# EasyEDA Pro project ProProject_Standalone Non Auto Modules_2024-08-11.epro

# Schematic INA219 V1.0
Create Date: 2024-08-10; Page Name: INA219 V1.0; Project Name: Standalone Non Auto Modules; Schematic Name: INA219 V1.0; Update Date: 2024-08-11; Drawn: Arwid Vasilev; Page Size: A4; Part Number: ARS_V002; Version: V1.0
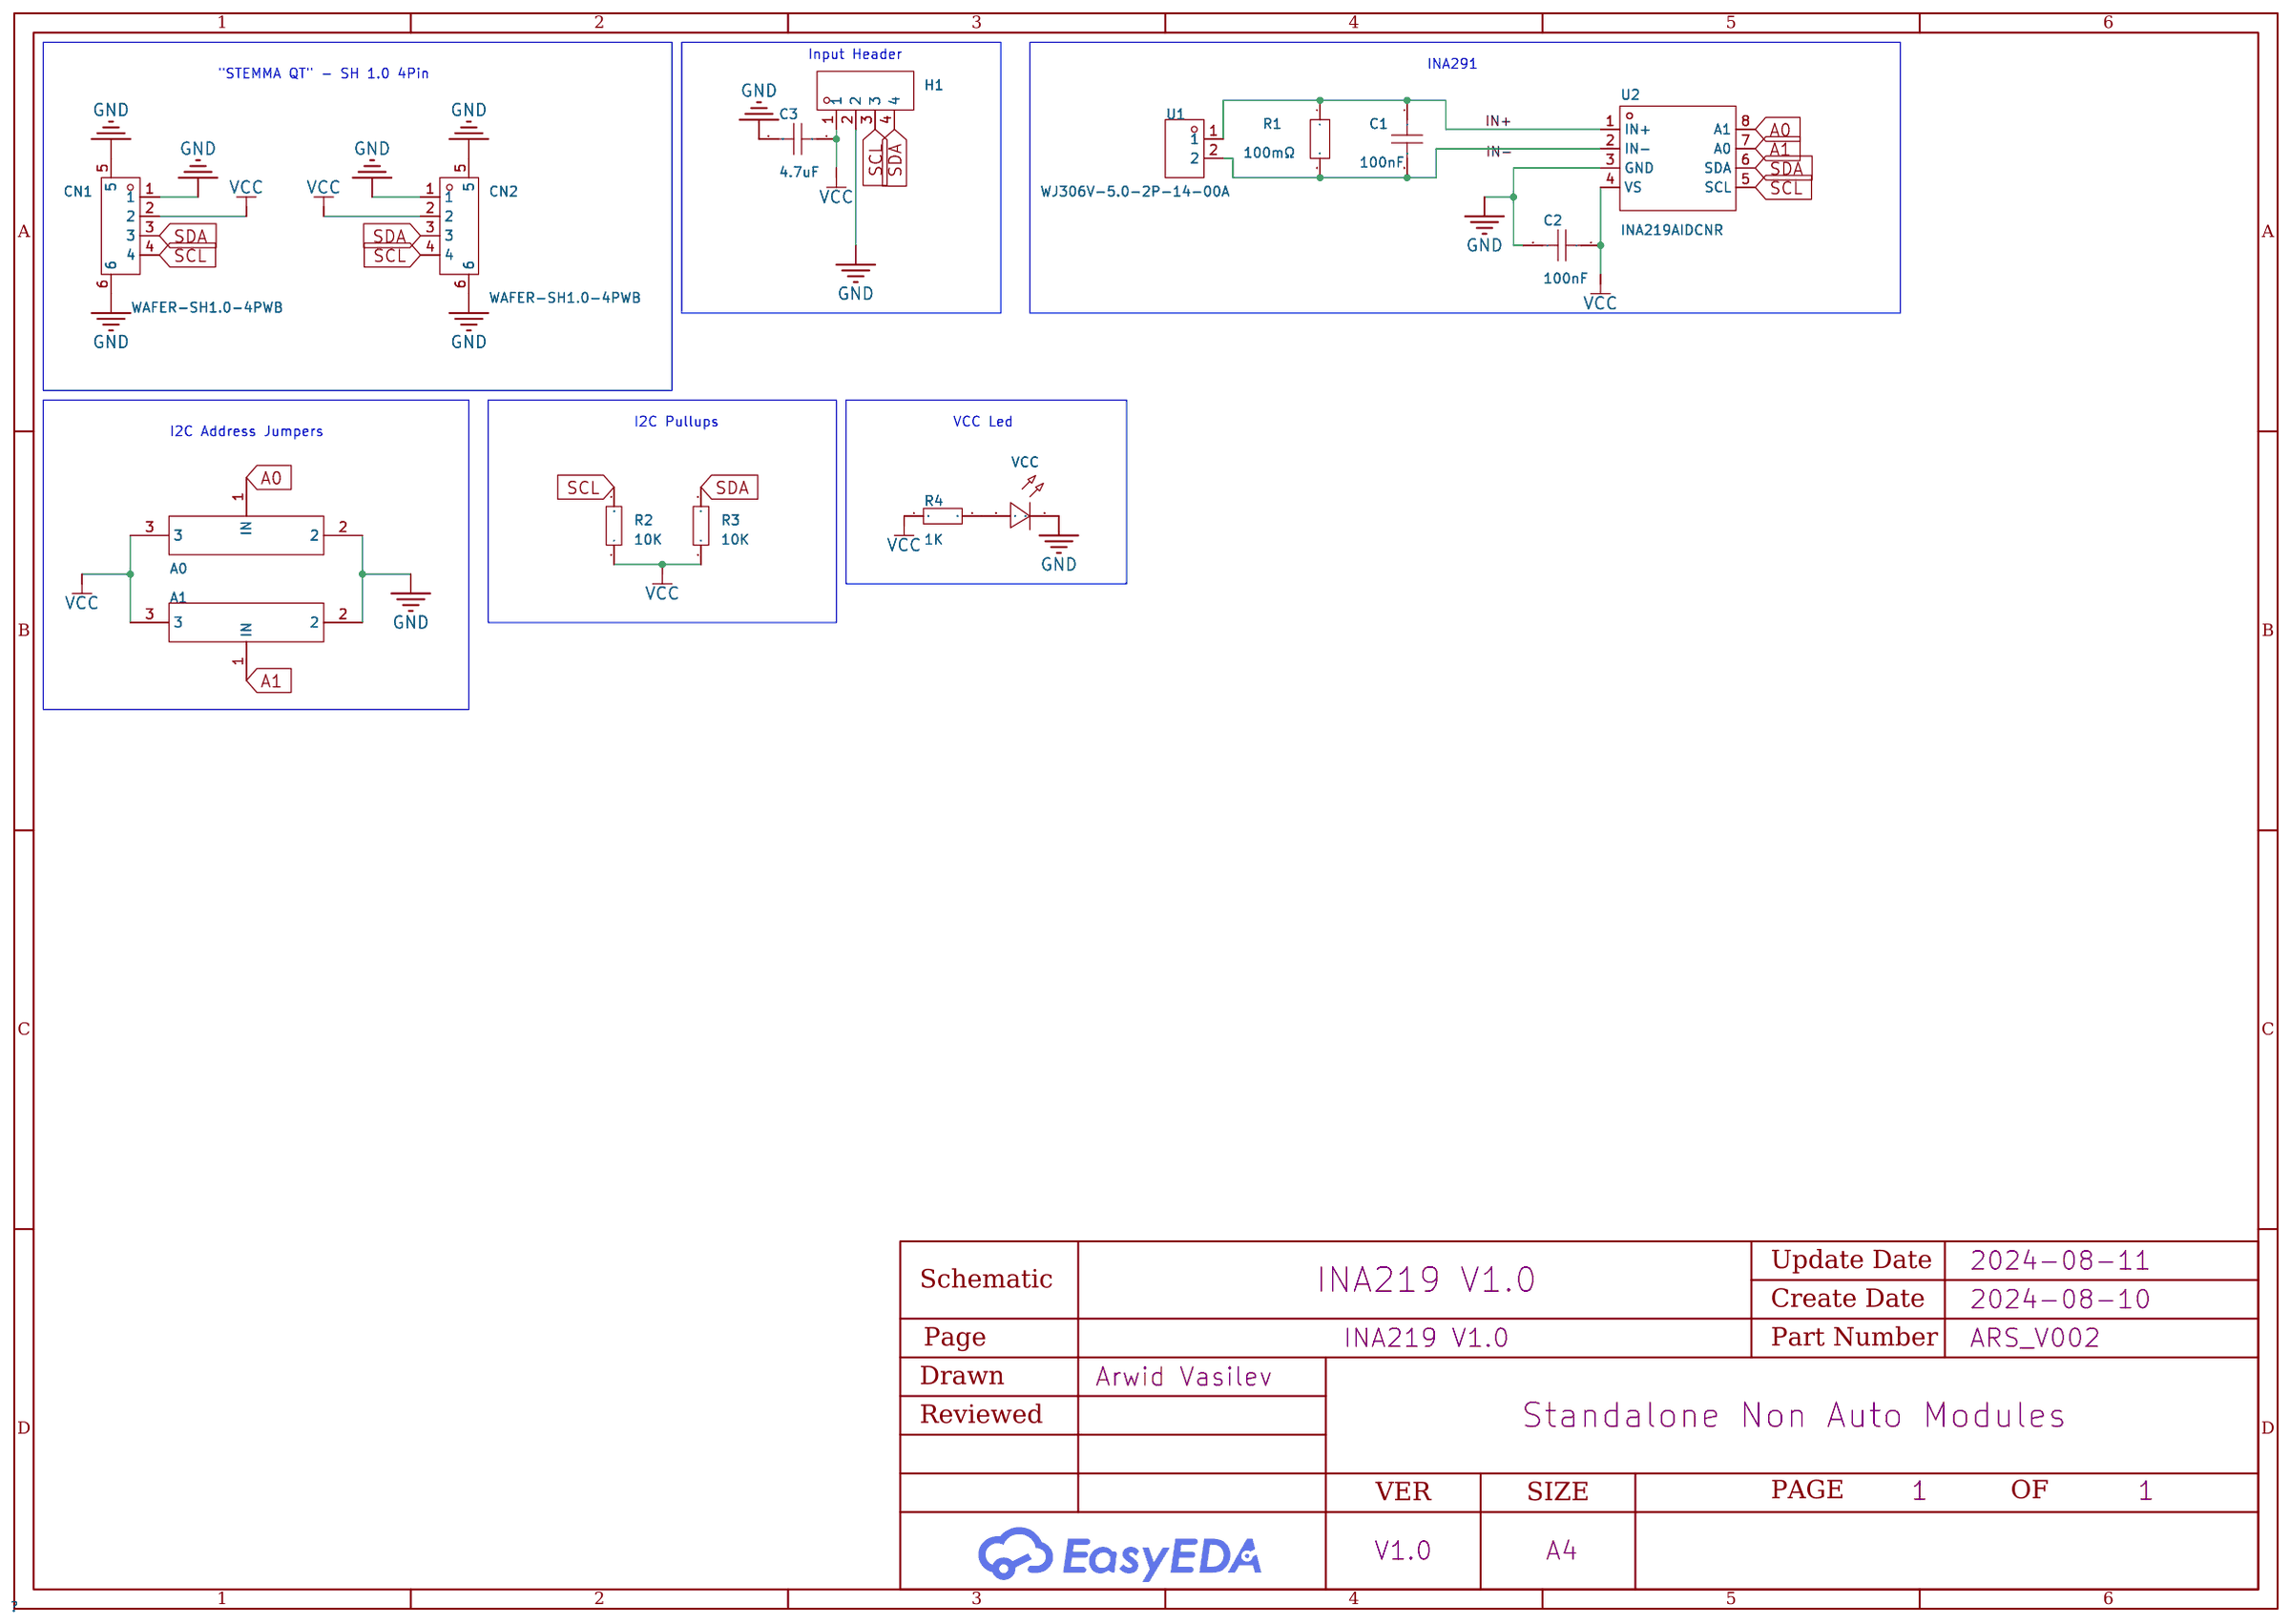
[diagram p0: schematic sheet]

## Parts
A0  -  [3 way solder Jumper]
A1  -  [3 way solder Jumper]
C1  100nF  [C0603]
C2  100nF  [C0603]
C3  4.7uF  [C0603]
CN1  WAFER-SH1.0-4PWB  [CONN-SMD_4P-P1.00_WAFER-SH1.0-4PWB]
CN2  WAFER-SH1.0-4PWB  [CONN-SMD_4P-P1.00_WAFER-SH1.0-4PWB]
H1  -  [HDR-TH_4P-P2.54-V-M]
R1  100mΩ  [RES-SMD_L6.4-W3.2-R2512]
R2  10K  [R0603]
R3  10K  [R0603]
R4  1K  [R0603]
U1  WJ306V-5.0-2P-14-00A  [CONN-TH_2P-P5.00_L7.6-W10.0]
U2  INA219AIDCNR  [SOT-23-8_L3.0-W1.7-P0.65-LS2.8-BR]
VCC  -  [LED0603-RD_GREEN]

## Library data of the parts
A0 A1 = 3 Way Solder Jumper
C1-C3 = CAP_0603: Supplier Footprint: 0603
CN1 CN2 = WAFER-SH1.0-4PWB: Pins Structure:1x4P Pitch:1mm Mounting Style:卧贴 Number of Pins:4P Number of Rows:1 Number of PINs Per Row:4 Current Rating (Max):1A Operating Temperature Range:-25℃~+85℃ Operating Temperature Range:-25℃~+85℃; LCSC Part Name: 1x4P 间距:1mm 卧贴; Supplier Part: C3029343; Manufacturer: XUNPU(讯普); Supplier Footprint: SMD,P=1mm,卧贴; JLCPCB Part Class: Extended Part; Datasheet: https://atta.szlcsc.com/upload/public/pdf/source/20220527/1879B8210BD3B2006BCEAC1A40D397B6.pdf; Supplier: LCSC; Pins Structure: 1x4P; Pitch: 1mm; Mounting Style: 卧贴; Number of Pins: 4P; Number of Rows: 1; Number of PINs Per Row: 4; Current Rating (Max): 1A; Operating Temperature Range: -25℃~+85℃
H1 = HDR-M_2.54_1x4P: Supplier Footprint: Through
R1 = HoJLR2512-3W-100mR-1%: Type:Current Sensing Resistors Resistance:100mΩ Tolerance:±1% Tolerance:±1% Power(Watts): Mounting Sytle:Surface Mount; LCSC Part Name: 100mΩ ±1% 3W; Supplier Part: C2903476; Manufacturer: Milliohm(毫欧); Supplier Footprint: 2512; JLCPCB Part Class: Extended Part; Datasheet: https://atta.szlcsc.com/upload/public/pdf/source/20211009/7525CABAB363C979E942C1DD41F1FEF0.pdf; Supplier: LCSC; Type: Current Sensing Resistors; Tolerance: ±1%; Mounting Sytle: Surface Mount
R2-R4 = Res_0603: Supplier Footprint: 0603
U1 = WJ306V-5.0-2P-14-00A: LCSC Part Name: 接线端子 直插式/5.0mm 2P 绿色 绿色; Supplier Part: C3031443; Manufacturer: KANGNEX(康奈克斯电气); Supplier Footprint: P=5mm; JLCPCB Part Class: Extended Part; Datasheet: https://atta.szlcsc.com/upload/public/pdf/source/20220629/C58904DE4C7373837BBB74E73B3FE59B.pdf; Supplier: LCSC
U2 = INA219AIDCNR: Supplier Part: C87469; Manufacturer: TI(德州仪器); Supplier Footprint: SOT-23-8; JLCPCB Part Class: Extended Part; Datasheet: https://www.ti.com/cn/lit/gpn/ina219; Supplier: LCSC
VCC = LED_0603-G

## Nets
GND: A0.2 A1.2 C2.2 C3.2 CN1.1 CN1.5 CN1.6 CN2.1 CN2.5 CN2.6 H1.2 U2.3(GND) VCC.1(C)
VCC: A0.3 A1.3 C2.1 C3.1 CN1.2 CN2.2 H1.1 R2.1 R3.1 R4.1 U2.4(VS)
A0: A0.1(IN) U2.8(A1)
A1: A1.1(IN) U2.7(A0)
IN+: C1.1 R1.1 U1.1 U2.1(IN+)
IN-: C1.2 R1.2 U1.2 U2.2(IN-)
SCL: CN1.4 CN2.4 H1.3 R2.2 U2.5(SCL)
SDA: CN1.3 CN2.3 H1.4 R3.2 U2.6(SDA)
$1N1921: R4.2 VCC.2(A)

## Notes on the sheet
- Input Header
- "STEMMA QT" - SH 1.0 4Pin
- INA291
- I2C Pullups
- VCC Led
- I2C Address Jumpers

# Board Adafruit_INA219_CurPowerMonitor
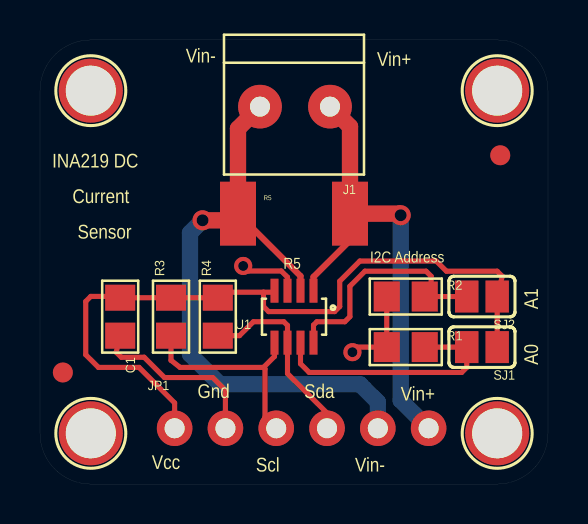
[diagram p1: board, top side]
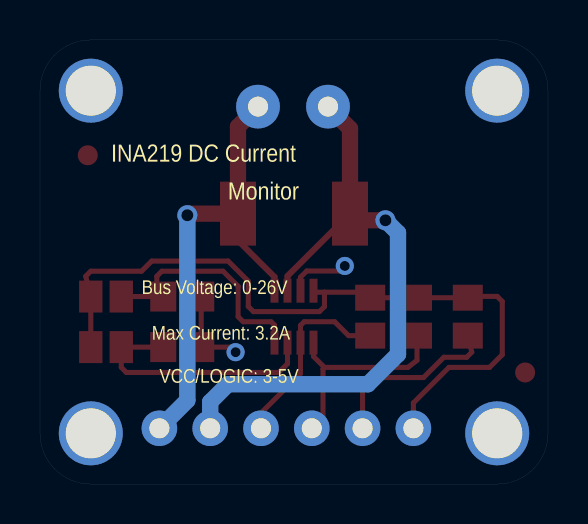
[diagram p2: board, bottom side, seen from below]

Outline 25.4 x 22.24 mm; copper layers: Top Layer, Bottom Layer. Coordinates in mm from the lower left corner of the outline.
Outline path: 0,19.7 arc(0.74,21.5) 2.54,22.24 22.86,22.24 arc(24.66,21.5) 25.4,19.7 25.4,2.54 arc(24.66,0.74) 22.86,0 2.54,0 arc(0.74,0.74) 0,2.54 0,19.7
Stack: Top Layer 0.035mm / Dielectric1 1.51mm FR4 er 4.5 / Bottom Layer 0.035mm

## Design rules (mm)
spacing safeClearance (default): track to track 0.203, other pairs 0 to 0.203
track width trackWidth (default): min 0.003, default 0.003, max 2.54
differential pair differentialPair (default): width min 0.127, default 0.254, max 2.54; gap min 0.152, default 0.152
via viaSize (default): diameter min 0, default 0, max 2.6; hole min 0, default 0, max 2

## Placement (name value [footprint] x y rotation side)
C1  0.1µF  [0805]  4.01 8.38 270 top
FID1  FIDUCIAL""  [FIDUCIAL_1MM]  23.01 16.47 0 top
FID2  FIDUCIAL""  [FIDUCIAL_1MM]  1.14 5.59 0 top
J1  TERMBLOCK_1X2-3.5MM  [1X2-3.5MM]  12.8 18.9 180 top
JP1  -  [1X06_ROUND_70]  13.08 2.79 0 top
R1  10K  [0805]  18.29 6.86 0 top
R2  10K  [0805]  18.29 9.39 0 top
R3  10K  [0805]  6.55 8.38 90 top
R4  10K  [0805]  8.89 8.38 90 top
R5  0.1/1% (PT2512FK-070R1L)  [2512]  12.7 13.54 0 top
SJ1  -  [SOLDERJUMPER_REFLOW_NOPASTE]  22.1 6.86 180 top
SJ2  -  [SOLDERJUMPER_REFLOW_NOPASTE]  22.1 9.39 180 top
U1  INA219BIDCNT  [SOT23-8]  12.7 8.38 180 top
U$7  MOUNTINGHOLE2.5  [MOUNTINGHOLE_2.5_PLATED]  22.86 2.54 0 top
U$8  MOUNTINGHOLE2.5  [MOUNTINGHOLE_2.5_PLATED]  2.54 2.54 0 top
U$9  MOUNTINGHOLE2.5  [MOUNTINGHOLE_2.5_PLATED]  2.54 19.7 0 top
U$10  MOUNTINGHOLE2.5  [MOUNTINGHOLE_2.5_PLATED]  22.86 19.7 0 top
U$11  -  [ADAFRUIT_3.5MM]  17.17 14.18 0 top

## Footprints (pads in the part's own frame, mm; a bottom-side part is the same pattern mirrored in y, then rotated)
1X2-3.5MM
  round 2.184 hole 1: 1(1.8,0) 2(-1.7,0)
1X06_ROUND_70
  round 1.778 hole 1: 1(-6.35,0) 2(-3.81,0) 3(-1.27,0) 4(1.27,0) 5(3.81,0) 6(6.35,0)
0805
  rect 1.3x1.5 smd: 1(-0.95,0) 2(0.95,0)
2512
  rect 1.8x3.2 smd: 1(-2.8,0) 2(2.8,0)
FIDUCIAL_1MM
  round 1 smd: 1(0,0)
MOUNTINGHOLE_2.5_PLATED
  round 3.2 hole 2.5: P$1(0,0)
SOLDERJUMPER_REFLOW_NOPASTE
  rect 1.169x1.6 smd: 1(-0.762,0) 2(0.762,0)
SOT23-8
  rect 0.4x1.2 smd: 1(-0.975,-1.3) 2(-0.325,-1.3) 3(0.325,-1.3) 4(0.975,-1.3) 5(0.975,1.3) 6(0.325,1.3) 7(-0.325,1.3) 8(-0.975,1.3)

## Nets
GND: C1.2 JP1.2 R1.1 R2.1 U1.3
VCC: C1.1 JP1.1 R3.2 R4.2 SJ1.1 SJ2.1 U1.4
VIN+: J1.2 JP1.6 R5.2 U1.1
VIN-: J1.1 JP1.5 R5.1 U1.2
N$1: R2.2 SJ2.2 U1.8
N$2: R1.2 SJ1.2 U1.7
SCL: JP1.3 R3.1 U1.5
SDA: JP1.4 R4.1 U1.6

Pads without a net: FID1 1; FID2 1; U$7 P$1; U$8 P$1; U$9 P$1; U$10 P$1

## Via types
v1: diameter 0.906, hole 0.5, Top Layer to Bottom Layer, 2 vias
v2: diameter 1.006, hole 0.6, Top Layer to Bottom Layer, 2 vias

## Routing (per net, layer and track width the routed paths; a pad name or vN(x,y) marks a point on that pad's centre or on a via; arc(x,y) is an arc through that point)
GND: length 17
  Top Layer w0.254: C1.2 3.81,6.6 4.06,6.35 5.21,6.35 6.22,5.33 8.64,5.33 9.27,4.7 JP1.2 9.14,2.92 ; v1(15.62,6.6) 15.88,6.86 17.34,6.86 17.34,9.39 ; U1.3 12.38,10.36 12.06,10.67 10.41,10.67 v1(10.16,10.92)
  Bottom Layer w0.254: v1(10.16,10.92) 9.91,10.92 ; v1(15.62,6.6) 15.62,6.48
VCC: length 37.5
  Top Layer w0.254: SJ1.1 SJ2.1 23.11,10.41 22.86,10.66 20.32,10.66 19.81,11.17 15.99,11.17 14.99,10.16 14.99,8.89 14.73,8.64 11.43,8.64 11.18,8.89 11.18,9.61 ; 11.18,9.61 11.65,9.61 U1.4 ; 11.18,9.61 9.17,9.61 R4.2 R3.2 C1.1 3.74,9.4 2.54,9.4 2.29,9.14 2.29,6.48 2.92,5.84 4.95,5.84 6.73,4.06 JP1.1
VIN+: length 24.2
  Top Layer w0.305: R5.2 15.49,13.53 15.49,12.19 13.68,10.37 U1.1
  Top Layer w0.813: J1.2 15.5,17.9 R5.2 17.96,13.54 v2(18.03,13.46)
  Bottom Layer w0.813: v2(18.03,13.46) 18.03,4.19 JP1.6
VIN-: length 31.5
  Top Layer w0.305: U1.2 13.03,10.42 R5.1
  Top Layer w0.813: J1.1 9.9,17.8 R5.1 9.57,13.21 v2(8.13,13.21)
  Bottom Layer w0.813: v2(8.13,13.21) 7.5,12.58 7.5,6.5 9,5 16,5 16.89,4.11 JP1.5
N$1: length 12.3
  Top Layer w0.254: U1.8 13.68,7.96 13.84,8.13 15.24,8.13 15.49,8.38 15.49,9.91 16.25,10.66 19.3,10.66 19.56,10.41 19.56,9.46 R2.2 SJ2.2
N$2: length 12.8
  Top Layer w0.254: R1.2 SJ1.2 21.34,5.84 21.08,5.59 13.46,5.59 13.03,6.02 U1.7
SCL: length 10.8
  Top Layer w0.254: 11.18,5.84 7,5.84 6.55,6.2 R3.1 ; 11.18,5.84 11.72,6.39 U1.5 ; 11.18,5.84 11.25,5.77 11.25,3.36 JP1.3
SDA: length 9.8
  Top Layer w0.254: JP1.4 14.35,3.56 12.38,5.53 U1.6 12.38,7.94 12.19,8.13 10.67,8.13 9.97,7.43 R4.1

## Text on the board
Bottom Silkscreen Layer: VCC/LOGIC: 3-5V | Max Current: 3.2A | Bus Voltage: 0-26V | Monitor | INA219 DC Current
Top Silkscreen Layer: R5 | I2C Address | INA219 DC | Current | Sensor | Vcc | Gnd | Scl | Sda | Vin- | Vin+ | A1 | A0

# Board INA219 V1.0
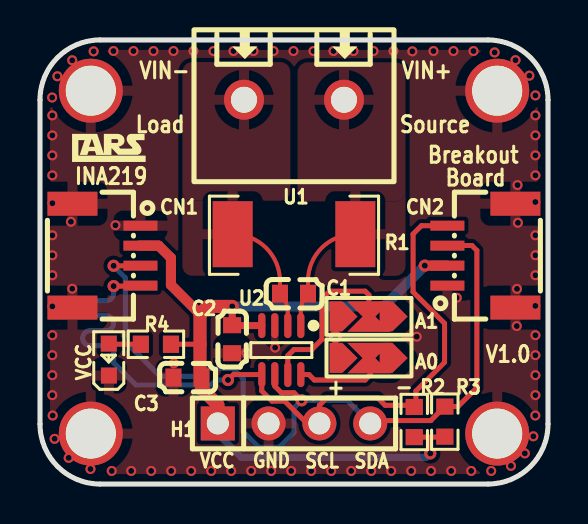
[diagram p3: board, top side]
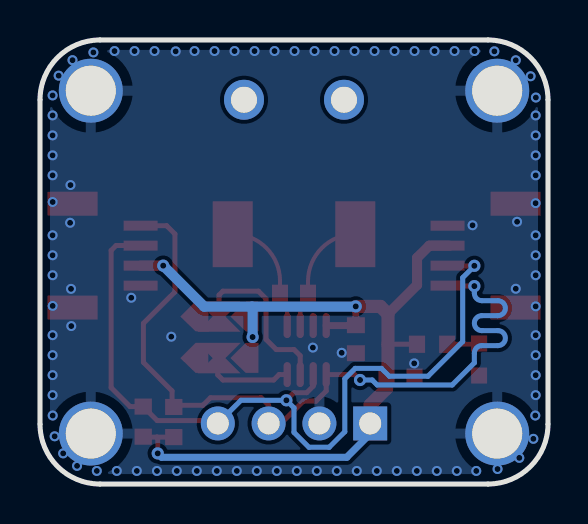
[diagram p4: board, bottom side, seen from below]

Outline 25.4 x 22.22 mm; copper layers: Top Layer, Bottom Layer. Coordinates in mm from the lower left corner of the outline.
Outline path: 0,19.22 0,3 arc(0.88,0.88) 3,0 22.4,0 arc(24.52,0.88) 25.4,3 25.4,19.22 arc(24.52,21.35) 22.4,22.22 3,22.22 arc(0.88,21.35) 0,19.22
Stack: Top Layer 0.035mm / Dielectric1 1.51mm FR4 er 4.5 / Bottom Layer 0.035mm

## Design rules (mm)
net IN+: Kelvin
net IN-: Kelvin
net SDA: I2C
net SCL: I2C
template: JLCPCB Capability(Two Layers Board)
spacing copperThickness1oz (default): track to track 0.102, other pairs 0.152 to 0.3
spacing copperThickness2oz: track to track 0.203, other pairs 0.152 to 0.3
track width copperThickness1oz (default): min 0.127, default 0.254, max 2.54
track width copperThickness2oz: min 0.203, default 0.254, max 2.54
differential pair differentialPair (default): width min 0.127, default 0.254, max 2.54; gap min 0.152, default 0.152
via viaSize (default): diameter min 0.5, default 0.61, max 10; hole min 0.3, default 0.305, max 6.3

## Placement (name value [footprint] x y rotation side)
A0  -  [3 way solder Jumper]  14.48 7.06 0 top
A1  -  [3 way solder Jumper]  14.48 9.14 0 top
C1  100nF  [C0603]  12.7 9.52 180 top
C2  100nF  [c0603]  9.61 7.25 270 top
C3  4.7uF  [c0603]  7.37 5.33 180 top
CN1  WAFER-SH1.0-4PWB  [conn-smd_4p-p1.00_wafer-sh1.0-4pwb]  3.32 11.43 270 top
CN2  WAFER-SH1.0-4PWB  [conn-smd_4p-p1.00_wafer-sh1.0-4pwb]  22.07 11.43 90 top
H1  -  [hdr-th_4p-p2.54-v-m]  12.7 3.03 0 top
NOREF  -  [Pad_e3]  22.86 19.68 0 top
NOREF#2  -  [Pad_e1]  2.54 19.68 0 top
NOREF#3  -  [Pad_e5]  2.54 2.52 0 top
NOREF#4  -  [Pad_e4]  22.86 2.52 0 top
R1  100mΩ  [res-smd_l6.4-w3.2-r2512]  12.7 12.5 180 top
R2  10K  [R0603]  18.71 3.1 90 top
R3  10K  [R0603]  20.24 3.12 90 top
R4  1K  [R0603]  5.8 7 180 top
U1  WJ306V-5.0-2P-14-00A  [conn-th_2p-p5.00_l7.6-w10.0]  12.7 19.23 180 top
U2  INA219AIDCNR  [sot-23-8_l3.0-w1.7-p0.65-ls2.8-br]  12.06 6.7 90 top
VCC  -  [LED0603-RD_GREEN]  3.44 6.23 90 top

## Footprints (pads in the part's own frame, mm; a bottom-side part is the same pattern mirrored in y, then rotated)
3 way solder Jumper
  custom 2.159x1.524 smd: 1(1.968,-0.762)
  custom 1.402x1.503 smd: 2(3.201,-0.75) 3(0.696,-0.75)
C0603
  rect 0.8x0.9 smd: 1(-0.7,0) 2(0.7,0)
c0603
  rect 0.8x0.9 smd: 1(-0.7,0) 2(0.7,0)
conn-smd_4p-p1.00_wafer-sh1.0-4pwb
  rect 0.5x1.7 smd: 1(-1.5,1.7) 2(-0.5,1.7) 3(0.5,1.7) 4(1.5,1.7)
  rect 1.2x2.5 smd: 5(-2.6,-1.7) 6(2.6,-1.7)
conn-th_2p-p5.00_l7.6-w10.0
  round 2 hole 1.3: 1(-2.5,0) 2(2.5,0)
hdr-th_4p-p2.54-v-m
  rect 1.7x1.7 hole 1.1: 1(-3.81,0)
  round 1.7 hole 1.1: 2(-1.27,0) 3(1.27,0) 4(3.81,0)
LED0603-RD_GREEN
  rect 0.8x0.8 smd: 1(-0.799,-0.004) 2(0.799,0.004)
Pad_e1
  round 3.2 hole 2.5: 1(0,0)
Pad_e3
  round 3.2 hole 2.5: 1(0,0)
Pad_e4
  round 3.2 hole 2.5: 1(0,0)
Pad_e5
  round 3.2 hole 2.5: 1(0,0)
R0603
  rect 0.806x0.864 smd: 1(-0.753,0) 2(0.753,0)
res-smd_l6.4-w3.2-r2512
  rect 2x3.3 smd: 1(-3.067,0) 2(3.067,0)
sot-23-8_l3.0-w1.7-p0.65-ls2.8-br
  oval 1.252x0.364 smd: 1(1.226,-0.975) 2(1.226,-0.325) 3(1.226,0.325) 4(1.226,0.975) 5(-1.226,0.975) 6(-1.226,0.325) 7(-1.226,-0.325) 8(-1.226,-0.975)

## Nets
As in the schematic, except:
GND: A0.2 A1.2 C2.2 C3.2 CN1.1 CN1.5 CN1.6 CN2.1 CN2.5 CN2.6 H1.2 NOREF.1 NOREF#2.1 NOREF#3.1 NOREF#4.1 U2.3 VCC.1

## Via types
v1: diameter 0.5, hole 0.3, Top Layer to Bottom Layer, 93 vias
v2: diameter 0.61, hole 0.305, Top Layer to Bottom Layer, 8 vias

## Routing (per net, layer and track width the routed paths; a pad name or vN(x,y) marks a point on that pad's centre or on a via; arc(x,y) is an arc through that point)
GND:
  vias: v1(0.61,19.34) v1(0.62,18.45) v1(0.62,17.45) v1(0.62,16.45) v1(0.62,15.45) v1(0.62,14.06) v1(0.62,12.45) v1(0.62,11.45) v1(0.62,10.45) v1(0.62,8.89) v1(0.62,7.45) v1(0.62,6.45) v1(0.62,5.45) v1(0.62,4.45) v1(0.63,3.43) v1(0.73,2.26) v1(0.87,20.41) v1(1.43,1.31) v1(1.55,13.13) v1(1.61,21.21) v1(1.61,9.77) v1(2.52,0.75) v1(2.68,21.66) v1(3.59,0.66) v1(3.67,21.67) v1(3.77,12.95) v1(4.56,0.66) v1(4.67,21.67) v1(5.56,0.66) v1(5.67,21.67) v1(6.56,0.66) v1(6.67,21.67) v1(6.69,6.04) v1(7.56,0.66) v1(7.67,21.67) v1(8.56,0.66) v1(8.67,21.67) v1(9.56,0.66) v1(9.67,21.67) v1(10.32,6.57) v1(10.56,0.66) v1(10.67,21.67) v1(11.56,0.66) v1(11.67,21.67) v1(11.76,6.83) v1(12.56,0.66) v1(12.67,21.67) v1(13.56,0.66) v1(13.67,21.67) v1(14.56,0.66) v1(14.67,21.67) v1(15.56,0.66) v1(15.67,21.67) v1(16.56,0.66) v1(16.67,21.67) v1(17.56,0.66) v1(17.67,21.67) v1(18.62,21.66) v1(18.56,0.66) v1(18.84,7.37) v1(19.55,0.65) v1(19.67,21.67) v1(20.56,0.66) v1(20.67,21.67) v1(20.84,9.32) v1(21.56,0.66) v1(21.67,21.67) v1(22.56,0.66) v1(22.73,21.6) v1(23.55,0.91) v1(23.78,21.21) v1(23.85,9.77) v1(23.84,7.91) v1(23.88,14.96) v1(23.9,13.07) v1(24.24,1.53) v1(24.47,20.44) v1(24.67,2.39) v1(24.77,19.45) v1(24.77,18.45) v1(24.77,17.45) v1(24.77,16.45) v1(24.77,15.45) v1(24.77,14.12) v1(24.77,12.45) v1(24.77,11.45) v1(24.77,10.45) v1(24.77,8.92) v1(24.77,7.45) v1(24.77,6.45) v1(24.77,5.45) v1(24.77,4.45) v1(24.76,3.43)
VCC: length 44.4
  Top Layer w0.25: 19.56,2.35 20.22,2.35 R3.1 ; 19.56,2.35 R2.1 ; 19.56,2.35 19.51,2.31 v2(19.51,1.53) ; R4.1 7.99,7 8,6.99
  Top Layer w0.251: v2(14.77,7.36) 14.77,6.97 15.17,6.57
  Top Layer w0.351: U2.4 9.62,7.93 C2.1
  Top Layer w0.352: C2.1 9.61,7.95 v2(9.61,8.89)
  Top Layer w0.504: v2(19.24,10.93) 20.37,10.93
  Top Layer w0.505: 4.95,11.93 5.94,11.93 6.55,11.32 6.55,9.96 8,8.51
  Top Layer w0.657: 8,5.84 8,8.51 8.38,8.89 v2(9.61,8.89) ; H1.1 8.89,3.96 8.07,4.78 C3.1
  Bottom Layer w0.352: v2(19.51,1.53) 19.32,1.34 10.06,1.34 8.89,2.51 H1.1
  Bottom Layer w0.505: v2(9.61,8.89) 9.62,8.88 14.8,8.88 ; v2(14.77,7.36) 14.77,8.84 14.8,8.88 ; 14.8,8.88 17.19,8.88 v2(19.24,10.93)
A0: length 4.8
  Top Layer w0.251: U2.8 13.44,5.48 13.72,5.21 16.26,5.21 16.51,5.46 16.51,6.49 16.45,6.56
A1: length 8.7
  Top Layer w0.251: U2.7 12.39,6.42 12.7,6.73 13.59,6.73 14.1,7.24 14.1,9.27 14.48,9.65 16.26,9.65 16.45,9.46 A1.1
IN+: length 6
  Top Layer w0.2: U2.1 13.04,8.66 arc(13.13,9.13) C1.1 13.4,10.17 arc(14.08,11.82) 15.74,12.5 R1.1
IN-: length 6
  Top Layer w0.2: U2.2 12.39,8.58 arc(12.29,9.09) C1.2 12,10.15 arc(11.31,11.81) 9.64,12.5 R1.2
SCL: length 40.4
  Top Layer w0.25: 18.8,3.94 17.26,3.94 16.88,4.32 14.35,4.32 13.97,3.94 H1.3 13.35,3.03 12.24,4.15 11.6,4.15 11.09,4.66 U2.5 9.67,5.48 v2(9.4,5.21) ; 18.8,3.94 18.8,4.66 20.23,6.09 20.23,8.04 18.65,9.61 18.65,12.51 19.07,12.93 20.45,12.93 ; 18.8,3.94 R2.2 ; v2(3.68,9.91) 4.93,9.91 4.95,9.93
  Bottom Layer w0.25: v2(3.68,9.91) 3.68,9.55 arc(3.57,9.29) 3.31,9.18 2.51,9.18 arc(2.13,8.8) 2.51,8.43 3.31,8.43 arc(3.68,8.05) 3.31,7.68 2.51,7.68 arc(2.13,7.3) 2.51,6.93 3.31,6.93 arc(3.57,6.82) 3.68,6.55 3.68,6.06 4.79,4.96 8.54,4.96 8.79,5.21 v2(9.4,5.21)
SDA: length 40.4
  Top Layer w0.25: H1.4 16.65,3.17 19.54,3.17 R3.2 20.89,3.88 21.84,4.83 21.84,11.69 21.59,11.94 20.46,11.94 20.45,11.93 ; v2(13.08,4.19) 12.7,4.57 12.06,4.57 11.74,4.9 U2.6 ; v2(3.68,10.92) 4.94,10.92 4.95,10.93
  Bottom Layer w0.25: v2(3.68,10.92) 3.68,10.91 4.27,10.33 4.27,7.13 6,5.4 7.94,5.4 8.33,5.79 9.64,5.79 10.16,5.27 10.16,2.62 10.94,1.84 11.96,1.84 12.7,2.58 12.7,3.81 v2(13.08,4.19) 15.35,4.19 H1.4
$1N1921: length 1.6
  Top Layer w0.25: R4.2 3.47,7 VCC.2

## Copper pours and planes (outline as drawn; the poured copper is in the pictures)
GND on Top Layer: -0.06,19.83 -0.05,20.06 0,20.37 0.09,20.67 0.21,20.96 0.37,21.23 0.57,21.48 0.79,21.7 1.04,21.9 1.31,22.06 1.6,22.18 1.9,22.27 2.21,22.32 2.44,22.33 22.73,22.33 22.97,22.32 23.28,22.27 23.58,22.18 23.86,22.06 24.14,21.9 24.38,21.7 24.61,21.48 24.8,21.23 24.96,20.96 25.08,20.67 25.17,20.37 25.22,20.06 25.23,19.83 25.23,2.51 25.22,2.27 25.17,1.96 25.08,1.66 24.96,1.37 24.8,1.1 24.61,0.85 24.38,0.63 24.14,0.44 23.86,0.28 23.58,0.15 23.28,0.07 22.97,0.02 22.73,0.01 2.44,0.01 2.21,0.02 1.9,0.07 1.6,0.15 1.31,0.28 1.04,0.44 0.79,0.63 0.57,0.85 0.37,1.1 0.21,1.37 0.09,1.66 0,1.96 -0.05,2.27 -0.06,2.51
GND on Bottom Layer: -0.15,19.88 -0.13,20.11 -0.09,20.42 0,20.72 0.13,21.01 0.29,21.28 0.48,21.53 0.7,21.75 0.95,21.95 1.22,22.11 1.51,22.23 1.81,22.32 2.12,22.37 2.35,22.38 23.1,22.38 23.34,22.37 23.65,22.32 23.95,22.23 24.24,22.11 24.51,21.95 24.76,21.75 24.98,21.53 25.17,21.28 25.33,21.01 25.46,20.72 25.54,20.42 25.59,20.11 25.6,19.88 25.6,2.37 25.59,2.14 25.54,1.83 25.46,1.53 25.33,1.24 25.17,0.97 24.98,0.72 24.76,0.5 24.51,0.31 24.24,0.15 23.95,0.02 23.65,-0.07 23.34,-0.11 23.1,-0.13 2.35,-0.13 2.12,-0.11 1.81,-0.07 1.51,0.02 1.22,0.15 0.95,0.31 0.7,0.5 0.48,0.72 0.29,0.97 0.13,1.24 0,1.53 -0.09,1.83 -0.13,2.14 -0.15,2.37
IN+ on Top Layer: 14.76,14.73 14.77,14.83 14.82,14.97 14.91,15.08 15.02,15.17 15.16,15.22 15.26,15.23 17.78,15.23 17.88,15.22 18.02,15.17 18.13,15.08 18.21,14.97 18.26,14.83 18.28,14.73 18.28,10.92 18.26,10.81 18.21,10.68 18.13,10.56 18.02,10.48 17.88,10.43 17.78,10.42 15.26,10.42 15.16,10.43 15.02,10.48 14.91,10.56 14.82,10.68 14.77,10.81 14.76,10.92
IN+ on Top Layer: 12.88,20.61 12.89,20.71 12.94,20.85 13.02,20.96 13.14,21.05 13.27,21.1 13.38,21.11 17.77,21.11 17.88,21.1 18.01,21.05 18.13,20.96 18.21,20.85 18.26,20.71 18.27,20.61 18.27,14.64 18.26,14.54 18.21,14.4 18.13,14.29 18.01,14.2 17.88,14.15 17.77,14.14 13.38,14.14 13.27,14.15 13.14,14.2 13.02,14.29 12.94,14.4 12.89,14.54 12.88,14.64
IN- on Top Layer: 7.12,20.62 7.13,20.73 7.18,20.86 7.27,20.97 7.38,21.06 7.51,21.11 7.62,21.12 12.02,21.12 12.12,21.11 12.26,21.06 12.37,20.97 12.46,20.86 12.51,20.73 12.52,20.62 12.52,14.68 12.51,14.58 12.46,14.44 12.37,14.33 12.26,14.24 12.12,14.19 12.02,14.18 7.62,14.18 7.51,14.19 7.38,14.24 7.27,14.33 7.18,14.44 7.13,14.58 7.12,14.68
IN- on Top Layer: 7.12,14.83 7.13,14.94 7.18,15.07 7.27,15.19 7.38,15.27 7.51,15.32 7.62,15.33 10.13,15.33 10.24,15.32 10.37,15.27 10.49,15.19 10.57,15.07 10.62,14.94 10.63,14.83 10.63,10.92 10.62,10.82 10.57,10.68 10.49,10.57 10.37,10.48 10.24,10.43 10.13,10.42 7.62,10.42 7.51,10.43 7.38,10.48 7.27,10.57 7.18,10.68 7.13,10.82 7.12,10.92

## Text on the board
Top Silkscreen Layer: VCC | GND | SCL | SDA | + | - | V1.0 | INA219 | Load | VIN- | Source | VIN+ | Breakout | Board
